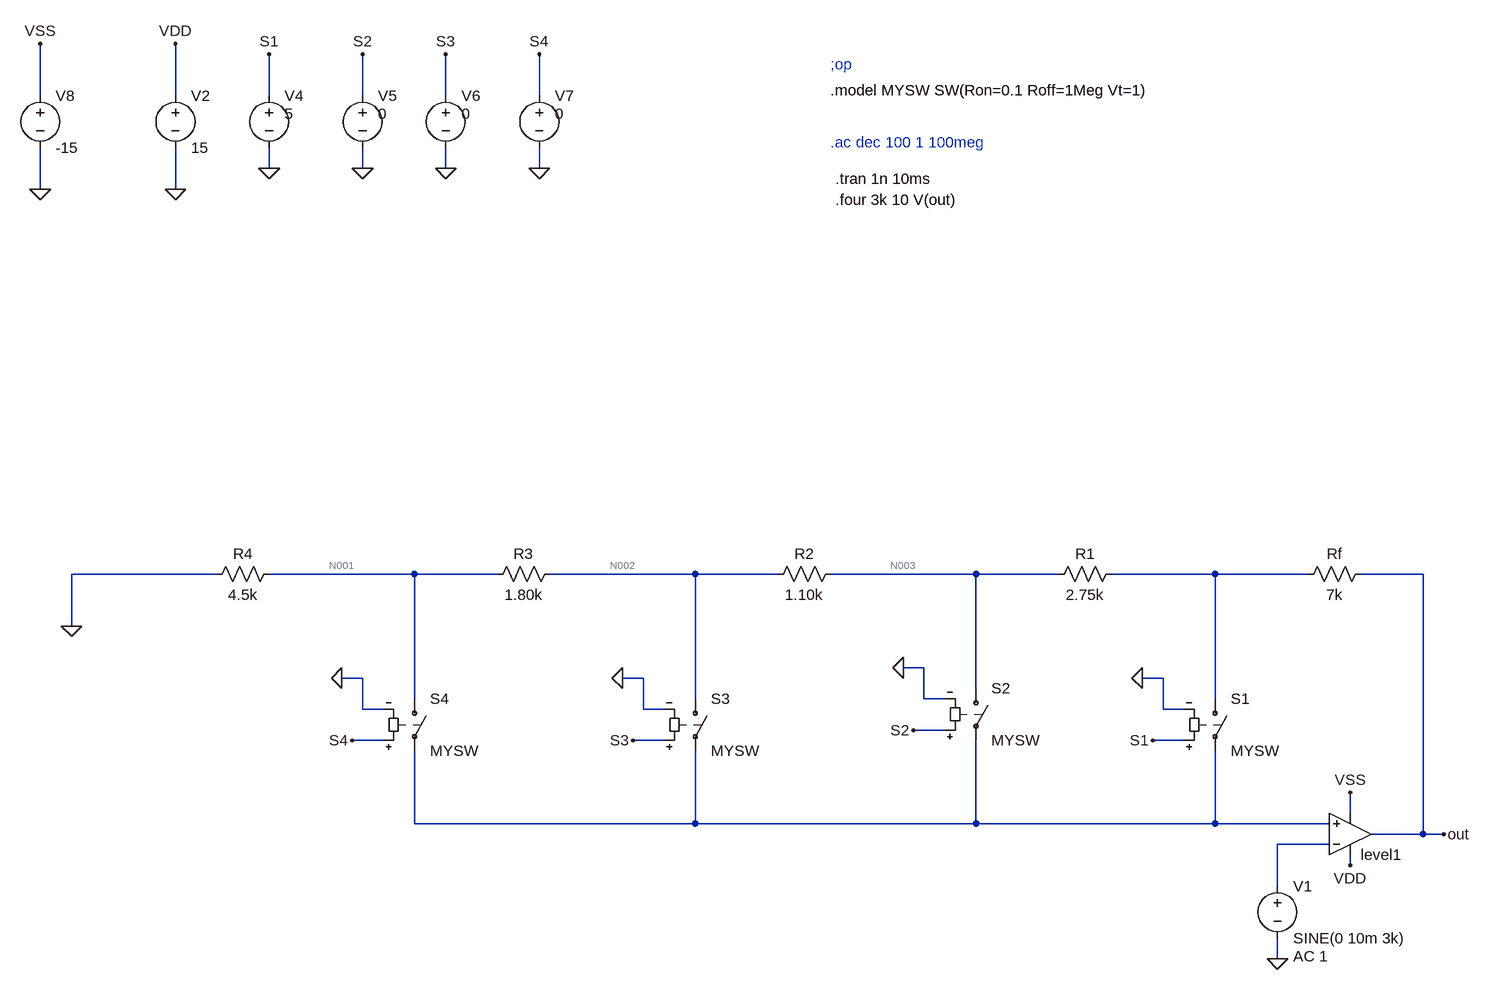
[diagram p0: schematic tb_PGA_serie_AO_ideal_switchIdeal-THD.asc]
tb_PGA_serie_AO_ideal_switchIdeal-THD.asc, the LTspice schematic file:
Version 4.1
SHEET 1 1988 2436
WIRE -1360 -240 -1360 -320
WIRE -1152 -240 -1152 -320
WIRE -1008 -240 -1008 -304
WIRE -864 -240 -864 -304
WIRE -736 -240 -736 -304
WIRE -592 -240 -592 -304
WIRE -1008 -128 -1008 -160
WIRE -864 -128 -864 -160
WIRE -736 -128 -736 -160
WIRE -592 -128 -592 -160
WIRE -1360 -96 -1360 -160
WIRE -1152 -96 -1152 -160
WIRE -1088 496 -1312 496
WIRE -784 496 -1008 496
WIRE -656 496 -784 496
WIRE -352 496 -576 496
WIRE -224 496 -352 496
WIRE 80 496 -144 496
WIRE 208 496 80 496
WIRE 448 496 288 496
WIRE 592 496 448 496
WIRE 768 496 672 496
WIRE -1312 576 -1312 496
WIRE 0 640 -32 640
WIRE -864 656 -896 656
WIRE -432 656 -464 656
WIRE 368 656 336 656
WIRE 80 672 80 496
WIRE -784 688 -784 496
WIRE -352 688 -352 496
WIRE 0 688 0 640
WIRE 32 688 0 688
WIRE 448 688 448 496
WIRE -864 704 -864 656
WIRE -832 704 -864 704
WIRE -432 704 -432 656
WIRE -400 704 -432 704
WIRE 368 704 368 656
WIRE 400 704 368 704
WIRE 32 736 -16 736
WIRE -832 752 -880 752
WIRE -400 752 -448 752
WIRE 400 752 352 752
WIRE 656 864 656 832
WIRE -784 880 -784 768
WIRE -352 880 -352 768
WIRE -352 880 -784 880
WIRE 80 880 80 752
WIRE 80 880 -352 880
WIRE 448 880 448 768
WIRE 448 880 80 880
WIRE 624 880 448 880
WIRE 768 896 768 496
WIRE 768 896 688 896
WIRE 800 896 768 896
WIRE 624 912 544 912
WIRE 656 944 656 928
WIRE 544 976 544 912
WIRE 544 1088 544 1056
FLAG -1152 -96 0
FLAG -1152 -320 VDD
FLAG 544 1088 0
FLAG -1008 -128 0
FLAG -1008 -304 S1
FLAG -864 -128 0
FLAG -864 -304 S2
FLAG -736 -128 0
FLAG -736 -304 S3
FLAG -592 -128 0
FLAG -592 -304 S4
FLAG 800 896 out
FLAG 656 944 VDD
FLAG 656 832 VSS
FLAG -1312 576 0
FLAG -1360 -96 0
FLAG -1360 -320 VSS
FLAG 352 752 S1
FLAG 336 656 0
FLAG -16 736 S2
FLAG -32 640 0
FLAG -448 752 S3
FLAG -464 656 0
FLAG -880 752 S4
FLAG -896 656 0
DATAFLAG 848 896 ""
SYMBOL voltage -1152 -256 R0
WINDOW 123 0 0 Left 2
WINDOW 39 0 0 Left 2
SYMATTR InstName V2
SYMATTR Value 15
SYMBOL voltage 544 960 R0
WINDOW 123 24 124 Left 2
WINDOW 39 0 0 Left 2
SYMATTR Value2 AC 1
SYMATTR InstName V1
SYMATTR Value SINE(0 10m 3k)
SYMBOL res 192 512 R270
WINDOW 0 32 56 VTop 2
WINDOW 3 0 56 VBottom 2
SYMATTR InstName R1
SYMATTR Value 2.75k
SYMBOL voltage -1008 -256 R0
WINDOW 123 0 0 Left 2
WINDOW 39 0 0 Left 2
WINDOW 3 24 44 Left 2
SYMATTR Value 5
SYMATTR InstName V4
SYMBOL voltage -864 -256 R0
WINDOW 123 0 0 Left 2
WINDOW 39 0 0 Left 2
WINDOW 3 24 44 Left 2
SYMATTR Value 0
SYMATTR InstName V5
SYMBOL voltage -736 -256 R0
WINDOW 123 0 0 Left 2
WINDOW 39 0 0 Left 2
WINDOW 3 24 44 Left 2
SYMATTR Value 0
SYMATTR InstName V6
SYMBOL voltage -592 -256 R0
WINDOW 123 24 44 Left 2
WINDOW 39 0 0 Left 2
WINDOW 3 24 44 Left 2
SYMATTR Value 0
SYMATTR InstName V7
SYMBOL res 688 480 R90
WINDOW 0 0 56 VBottom 2
WINDOW 3 32 56 VTop 2
SYMATTR InstName Rf
SYMATTR Value 7k
SYMBOL res -672 512 R270
WINDOW 0 32 56 VTop 2
WINDOW 3 0 56 VBottom 2
SYMATTR InstName R3
SYMATTR Value 1.80k
SYMBOL res -240 512 R270
WINDOW 0 32 56 VTop 2
WINDOW 3 0 56 VBottom 2
SYMATTR InstName R2
SYMATTR Value 1.10k
SYMBOL res -1104 512 R270
WINDOW 0 32 56 VTop 2
WINDOW 3 0 56 VBottom 2
SYMATTR InstName R4
SYMATTR Value 4.5k
SYMBOL sw 448 672 R0
SYMATTR InstName S1
SYMATTR Value MYSW
SYMBOL sw 80 656 R0
SYMATTR InstName S2
SYMATTR Value MYSW
SYMBOL sw -352 672 R0
SYMATTR InstName S3
SYMATTR Value MYSW
SYMBOL sw -784 672 R0
SYMATTR InstName S4
SYMATTR Value MYSW
SYMBOL voltage -1360 -256 R0
WINDOW 123 0 0 Left 2
WINDOW 39 0 0 Left 2
SYMATTR InstName V8
SYMATTR Value -15
SYMBOL OpAmps\\UniversalOpAmp1 656 896 M180
SYMATTR InstName level1
SYMATTR Value2 Avol=1Meg GBW=100Meg Vos=0
TEXT -144 -248 Left 2 !.model MYSW SW(Ron=0.1 Roff=1Meg Vt=1)
TEXT -144 -288 Left 2 ;;op
TEXT -144 -168 Left 2 ;.ac dec 100 1 100meg
TEXT -136 -112 Left 2 !.tran 1n 10ms
TEXT -136 -80 Left 2 !.four 3k 10 V(out)

The netlist it stands for:
* tb_PGA_serie_AO_ideal_switchIdeal-THD.asc
V2 VDD 0 15
V1 N006 0 SINE(0 10m 3k) AC 1
R1 N003 N004 2.75k
V4 S1 0 5
V5 S2 0 0
V6 S3 0 0
V7 S4 0 0
Rf out N004 7k
R3 N001 N002 1.80k
R2 N002 N003 1.10k
R4 0 N001 4.5k
S1 N004 N005 S1 0 MYSW
S2 N003 N005 S2 0 MYSW
S3 N002 N005 S3 0 MYSW
S4 N001 N005 S4 0 MYSW
V8 VSS 0 -15
X§level1 N005 N006 VDD VSS out level1 Avol=1Meg GBW=100Meg Vos=0 En=0 Enk=0 In=0 Ink=0 Rin=500Meg  ; pins In+ In- V+ V- OUT
.model MYSW SW(Ron=0.1 Roff=1Meg Vt=1)
* ;op
* .ac dec 100 1 100meg
.tran 1n 10ms
.four 3k 10 V(out)
.lib UniversalOpAmp1.lib
.backanno
.end

* Results of the author's LTspice run, read from the files saved beside the schematic
* Operating Point, zero values left out:
*   V(s1) = 5 V
*   V(vss) = -15 V
*   V(vdd) = 15 V
*   I(V2) = -30 nA
*   I(V8) = 30 nA
*   Ix(level1:3) = 30 nA
*   Ix(level1:4) = -30 nA
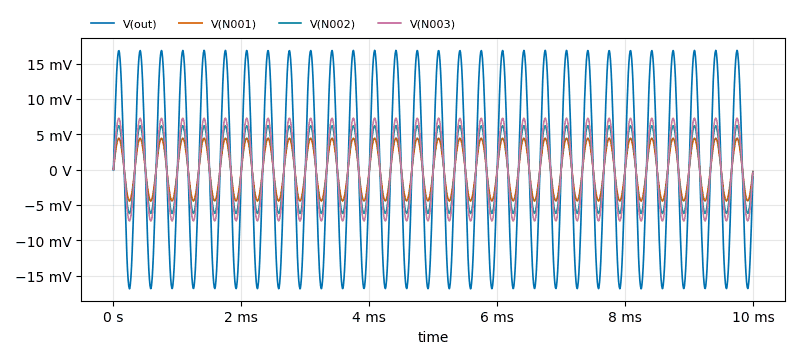
[diagram p1: Transient Analysis of tb_PGA_serie_AO_ideal_switchIdeal-THD.asc, plotted from the saved traces]
* Transient Analysis, 1 run:
*   V(out): min -16.86 mV, max 16.86 mV, average -310.1 nV, rms 11.89 mV, last -1.038 mV
*   V(N001): min -4.438 mV, max 4.438 mV, average -81.62 nV, rms 3.13 mV, last -273.1 µV
*   V(N002): min -6.204 mV, max 6.203 mV, average -114.1 nV, rms 4.374 mV, last -381.7 µV
*   V(N003): min -7.278 mV, max 7.277 mV, average -133.8 nV, rms 5.132 mV, last -447.8 µV
* From the log:
*   Fourier components of V(out)
*   N-Period=1
*   DC component:-8.45725e-06
*   Harmonic  Frequency   Fourier   Normalized   Phase    Normalized
*    Number     [Hz]     Component   Component  [degree]  Phase [deg]
*       1      3.000e+03   1.676e-02   1.000e+00     90.07°      0.00°
*       2      6.000e+03   2.399e-05   1.432e-03    176.48°     86.41°
*       3      9.000e+03   2.020e-05   1.205e-03   -146.22°   -236.29°
*       4      1.200e+04   1.737e-05   1.036e-03    167.48°     77.41°
*       5      1.500e+04   2.983e-05   1.780e-03    147.33°     57.26°
*       6      1.800e+04   2.275e-05   1.358e-03    168.28°     78.21°
*       7      2.100e+04   1.360e-05   8.113e-04   -163.96°   -254.04°
*       8      2.400e+04   1.798e-05   1.073e-03    158.00°     67.93°
*       9      2.700e+04   2.861e-05   1.707e-03    150.12°     60.05°
*      10      3.000e+04   2.130e-05   1.271e-03    158.24°     68.17°
*   Partial Harmonic Distortion: 0.399075%
*   Total Harmonic Distortion:   0.724177%